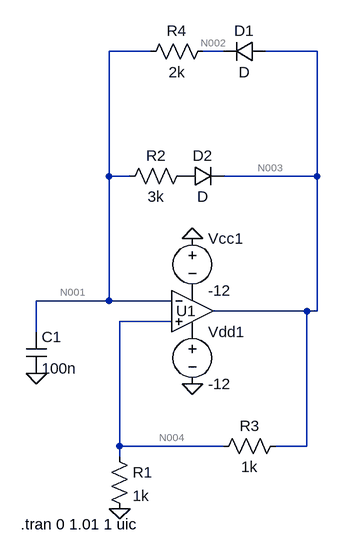
[diagram p0: schematic DutyCycleGenerator.asc]
DutyCycleGenerator.asc, the LTspice schematic file:
Version 4
SHEET 1 880 680
WIRE 112 -224 48 -224
WIRE 224 -224 192 -224
WIRE 368 -224 288 -224
WIRE 48 -32 48 -224
WIRE 80 -32 48 -32
WIRE 368 -32 368 -224
WIRE 368 -32 224 -32
WIRE 48 160 48 -32
WIRE 48 160 -64 160
WIRE 144 160 48 160
WIRE 352 176 208 176
WIRE 368 176 368 -32
WIRE 368 176 352 176
WIRE 144 192 64 192
WIRE -64 208 -64 160
WIRE 64 384 64 192
WIRE 224 384 64 384
WIRE 352 384 352 176
WIRE 352 384 304 384
WIRE 64 400 64 384
FLAG 176 64 0
FLAG 176 288 0
FLAG 64 480 0
FLAG -64 272 0
SYMBOL Opamps\\UniversalOpamp2 176 176 R0
WINDOW 0 -25 0 Left 2
SYMATTR InstName U1
SYMBOL voltage 176 192 R0
WINDOW 123 0 0 Left 2
WINDOW 39 0 0 Left 2
SYMATTR InstName Vdd1
SYMATTR Value -12
SYMBOL voltage 176 48 R0
WINDOW 123 0 0 Left 2
WINDOW 39 0 0 Left 2
SYMATTR InstName Vcc1
SYMATTR Value -12
SYMBOL cap -80 208 R0
SYMATTR InstName C1
SYMATTR Value 100n
SYMBOL res 48 384 R0
SYMATTR InstName R1
SYMATTR Value 1k
SYMBOL res 176 -48 R90
WINDOW 0 0 56 VBottom 2
WINDOW 3 32 56 VTop 2
SYMATTR InstName R2
SYMATTR Value 3k
SYMBOL res 320 368 R90
WINDOW 0 0 56 VBottom 2
WINDOW 3 32 56 VTop 2
SYMATTR InstName R3
SYMATTR Value 1k
SYMBOL diode 288 -240 R90
WINDOW 0 0 32 VBottom 2
WINDOW 3 32 32 VTop 2
SYMATTR InstName D1
SYMBOL diode 160 -16 R270
WINDOW 0 32 32 VTop 2
WINDOW 3 0 32 VBottom 2
SYMATTR InstName D2
SYMBOL res 208 -240 R90
WINDOW 0 0 56 VBottom 2
WINDOW 3 32 56 VTop 2
SYMATTR InstName R4
SYMATTR Value 2k
TEXT -88 504 Left 2 !.tran 0 1.01 1 uic

The netlist it stands for:
* DutyCycleGenerator.asc
XU1 N004 N001 P001 P002 N003 level.2 Avol=1Meg GBW=10Meg Slew=10Meg ilimit=25m rail=0 Vos=0 phimargin=45 en=0 enk=0 in=0 ink=0 Rin=500Meg  ; pins IN+ IN- V+ V- OUT
Vdd1 P002 0 -12
Vcc1 0 P001 -12
C1 N001 0 100n
R1 N004 0 1k
R2 P003 N001 3k
R3 N003 N004 1k
D1 N003 N002 D
D2 P003 N003 D
R4 N002 N001 2k
.model D D
.lib standard.dio
.tran 0 1.01 1 uic
.lib UniversalOpamps2.sub
.backanno
.end

* Results of the author's LTspice run, read from the files saved beside the schematic
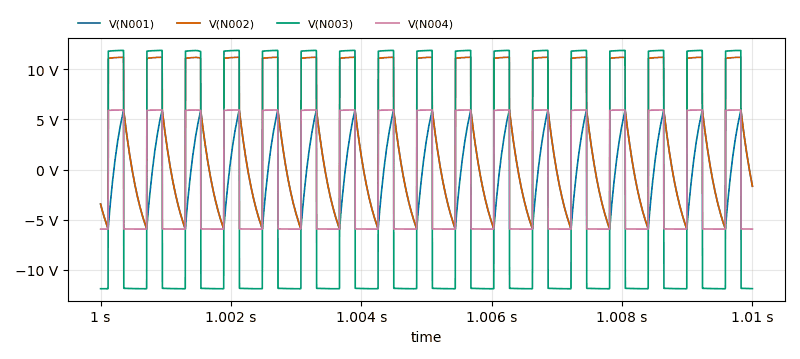
[diagram p1: Transient Analysis of DutyCycleGenerator.asc, plotted from the saved traces]
* Transient Analysis, 1 run:
*   V(N001): min -5.939 V, max 5.941 V, average -216.7 mV, rms 3.628 V, last -1.665 V
*   V(N002): min -5.938 V, max 11.22 V, average 3.847 V, rms 7.607 V, last -1.665 V
*   V(N003): min -11.91 V, max 11.9 V, average -2.306 V, rms 11.85 V, last -11.9 V
*   V(N004): min -5.956 V, max 5.95 V, average -1.153 V, rms 5.926 V, last -5.948 V